# Altium schematic sheet Hard.SchDoc
size 420 x 297 mm; SheetNumber: 2; SheetTotal: 3
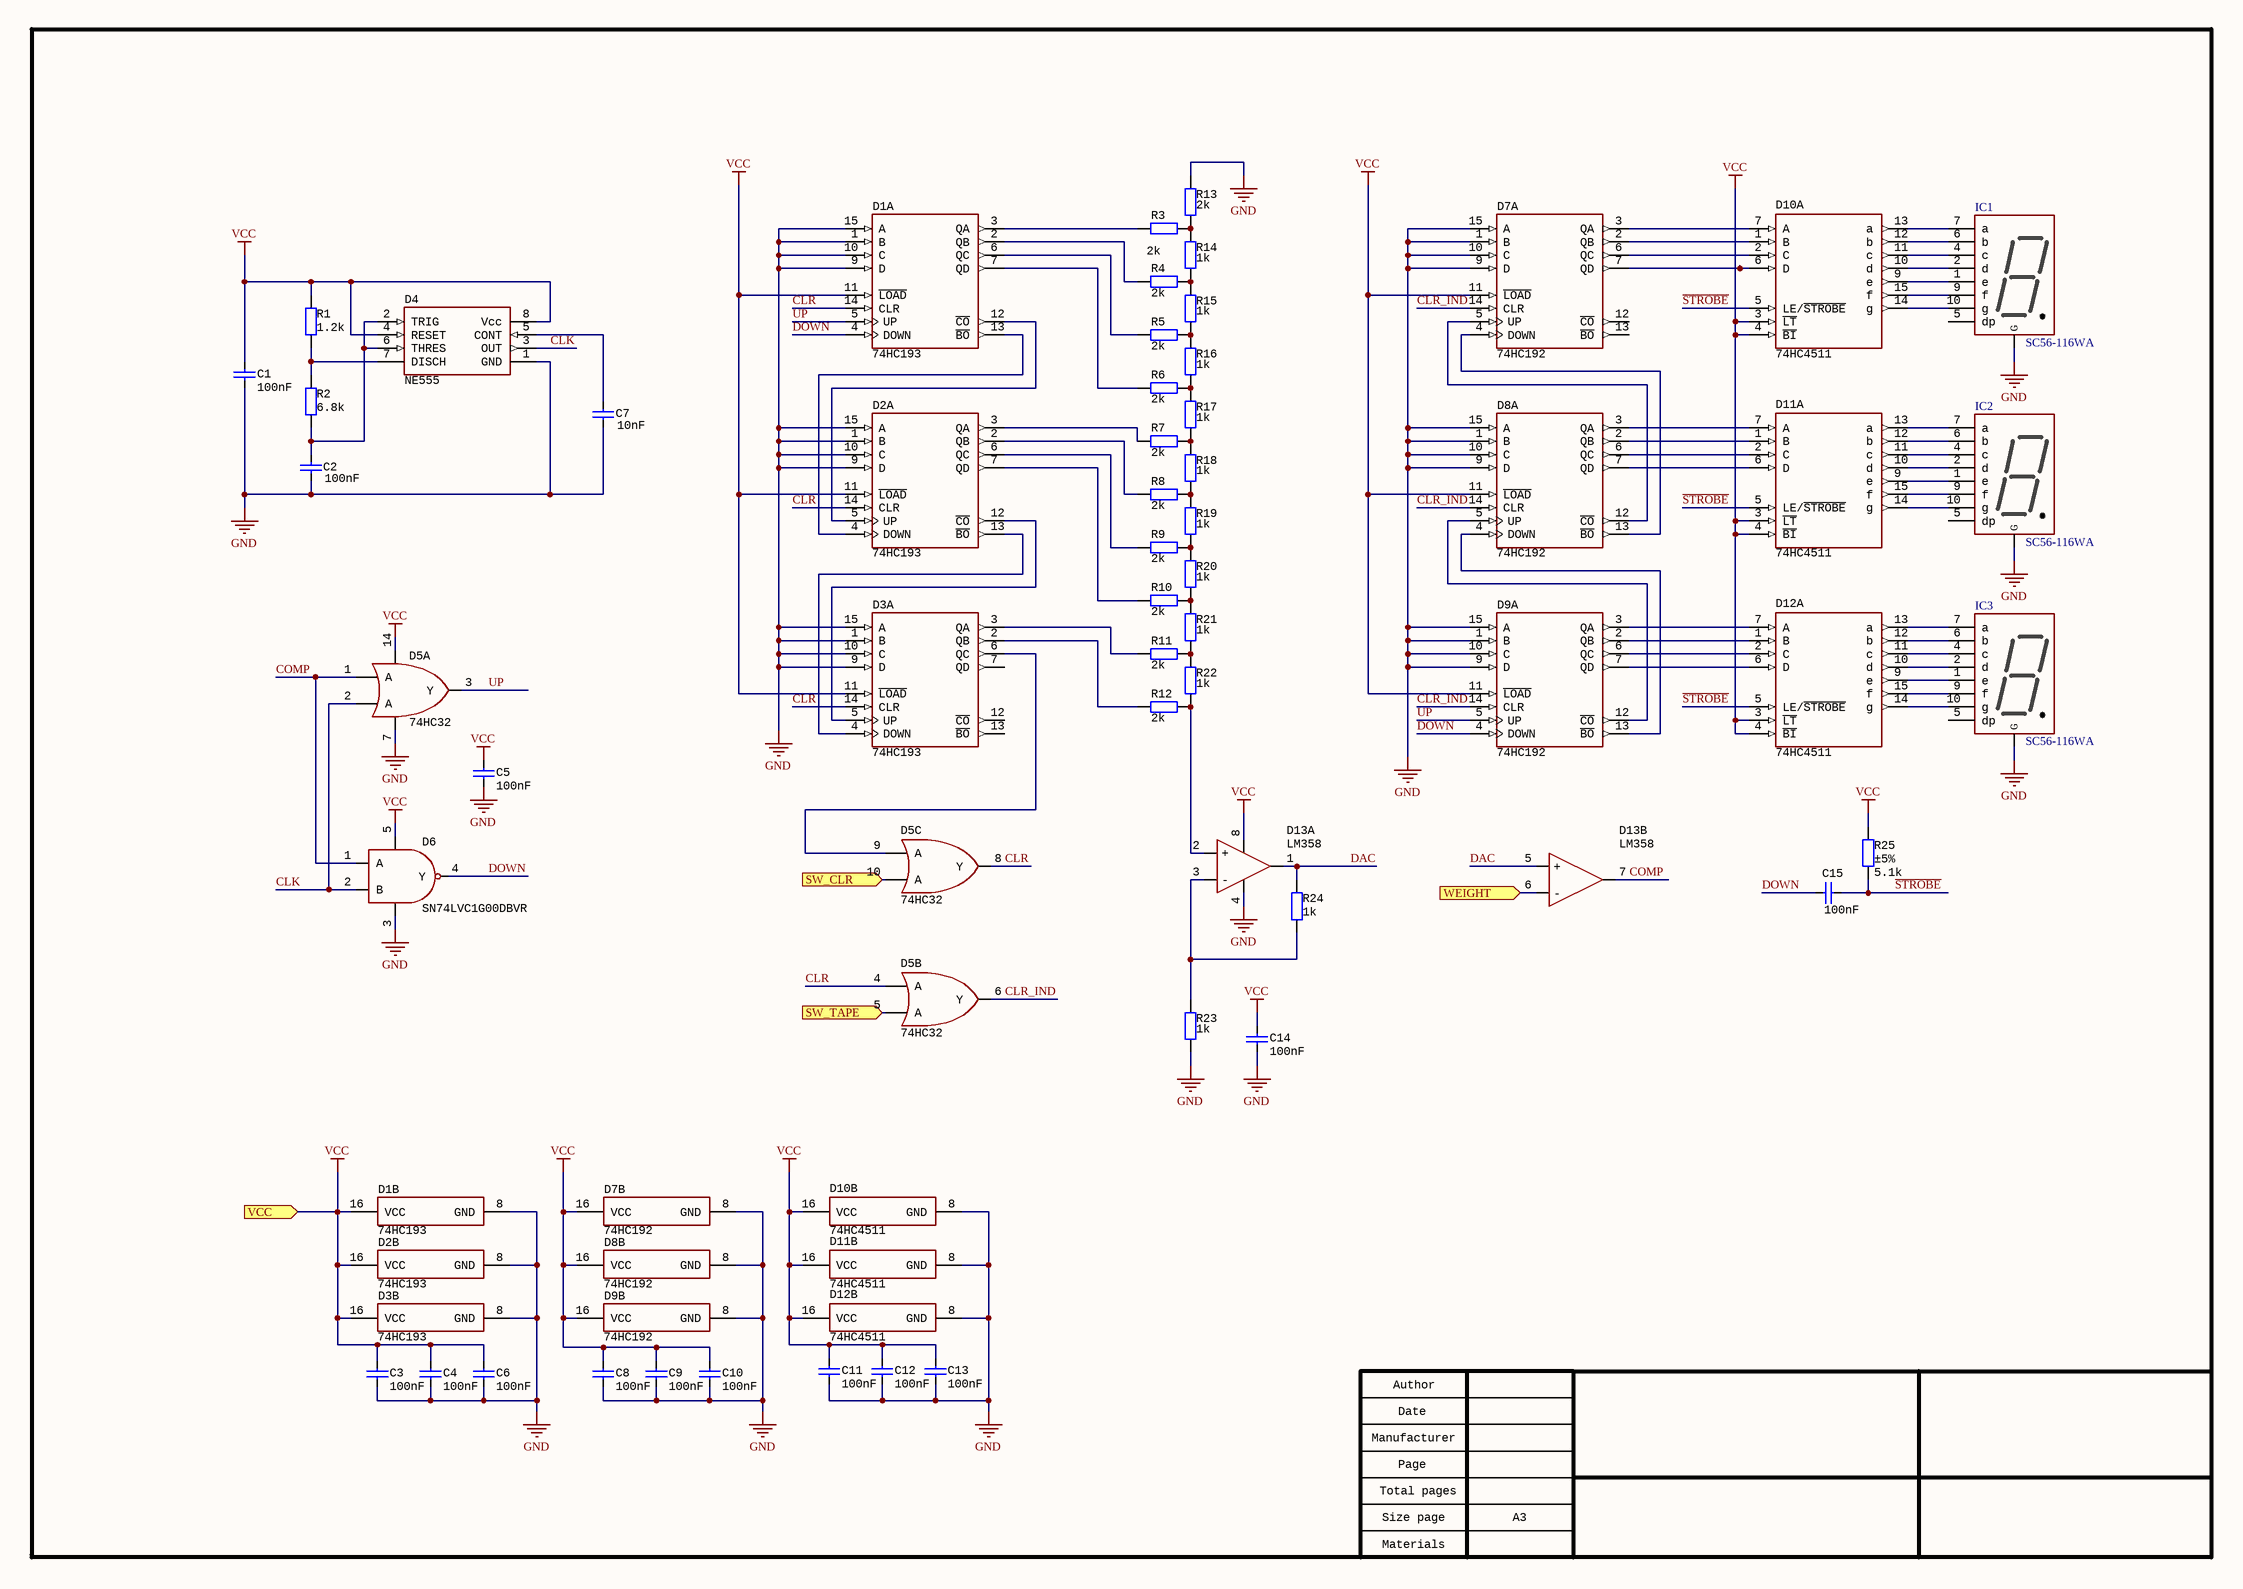
[diagram p0: Hard.SchDoc]

## Parts
C1  value 100nF  [CAP: ECHU(X) K (0603)]
C2  value 100nF  [CAP: ECHU(X) K (0603)]
C3  value 100nF  [CAP: ECHU(X) K (0603)]
C4  value 100nF  [CAP: ECHU(X) K (0603)]
C5  value 100nF  [CAP: ECHU(X) K (0603)]
C6  value 100nF  [CAP: ECHU(X) K (0603)]
C7  value 10nF  [CAP: ECHU(X) K (0603)]
C8  value 100nF  [CAP: ECHU(X) K (0603)]
C9  value 100nF  [CAP: ECHU(X) K (0603)]
C10  value 100nF  [CAP: ECHU(X) K (0603)]
C11  value 100nF  [CAP: ECHU(X) K (0603)]
C12  value 100nF  [CAP: ECHU(X) K (0603)]
C13  value 100nF  [CAP: ECHU(X) K (0603)]
C14  value 100nF  [CAP: ECHU(X) K (0603)]
C15  value 100nF  [CAP: ECHU(X) K (0603)]
D1  74HC193  [16-SO]  (parts A,B of 2)
D2  74HC193  [16-SO]  (parts A,B of 2)
D3  74HC193  [16-SO]  (parts A,B of 2)
D4  NE555  [8-SOIC]
D5  (no value)  [14-SOIC]  (parts A,B,C of 4)
D6  (no value)  [SOT23-5]
D7  74HC192  [16-SO]  (parts A,B of 2)
D8  74HC192  [16-SO]  (parts A,B of 2)
D9  74HC192  [16-SO]  (parts A,B of 2)
D10  74HC4511  [16-SO]  (parts A,B of 2)
D11  74HC4511  [16-SO]  (parts A,B of 2)
D12  74HC4511  [16-SO]  (parts A,B of 2)
D13  LM358  [8-SOIC]  (parts A,B of 2)
IC1  SC56-116WA  [SC56-116WA]
IC2  SC56-116WA  [SC56-116WA]
IC3  SC56-116WA  [SC56-116WA]
R1  value 1.2k  [RES: 0402]
R2  value 6.8k  [RES: 0402]
R3  value 2k  [RES: 0402]
R4  value 2k  [RES: 0402]
R5  value 2k  [RES: 0402]
R6  value 2k  [RES: 0402]
R7  value 2k  [RES: 0402]
R8  value 2k  [RES: 0402]
R9  value 2k  [RES: 0402]
R10  value 2k  [RES: 0402]
R11  value 2k  [RES: 0402]
R12  value 2k  [RES: 0402]
R13  value 2k  [RES: 0402]
R14  value 1k  [RES: 0402]
R15  value 1k  [RES: 0402]
R16  value 1k  [RES: 0402]
R17  value 1k  [RES: 0402]
R18  value 1k  [RES: 0402]
R19  value 1k  [RES: 0402]
R20  value 1k  [RES: 0402]
R21  value 1k  [RES: 0402]
R22  value 1k  [RES: 0402]
R23  value 1k  [RES: 0402]
R24  value 1k  [RES: 0402]
R25  value 5.1k  Tolerance: ±5%  [RES: 0402]

## Ports
SW_CLR (in), SW_TAPE (in), VCC (in), WEIGHT (in)

## Nets
GND: C1.1 C2.1 C3.1 C4.1 C5.1 C6.1 C7.1 C8.1 C9.1 C10.1 C11.1 C12.1 C13.1 C14.1 D1.1(B) D1.8(GND) D1.9(D) D1.10(C) D1.15(A) D2.1(B) D2.8(GND) D2.9(D) D2.10(C) D2.15(A) D3.1(B) D3.8(GND) D3.9(D) D3.10(C) D3.15(A) D4.1(GND) D5.7 D6.3 D7.1(B) D7.8(GND) D7.9(D) D7.10(C) D7.15(A) D8.1(B) D8.8(GND) D8.9(D) D8.10(C) D8.15(A) D9.1(B) D9.8(GND) D9.9(D) D9.10(C) D9.15(A) D10.8(GND) D11.8(GND) D12.8(GND) D13.4 IC1.G IC2.G IC3.G R13.2 R23.1
VCC: C1.2 C3.2 C4.2 C5.2 C6.2 C8.2 C9.2 C10.2 C11.2 C12.2 C13.2 C14.2 D1.11(~{LOAD}) D1.16(VCC) D2.11(~{LOAD}) D2.16(VCC) D3.11(~{LOAD}) D3.16(VCC) D4.4(RESET) D4.8(Vcc) D5.14 D6.5 D7.11(~{LOAD}) D7.16(VCC) D8.11(~{LOAD}) D8.16(VCC) D9.11(~{LOAD}) D9.16(VCC) D10.3(~{LT}) D10.4(~{BI}) D10.16(VCC) D11.3(~{LT}) D11.4(~{BI}) D11.16(VCC) D12.3(~{LT}) D12.4(~{BI}) D12.16(VCC) D13.8 R1.1 R25.2 ; port VCC
CLK: D4.3(OUT) D5.2(A) D6.2(B)
CLR: D1.14(CLR) D2.14(CLR) D3.14(CLR) D5.4(A) D5.8(Y)
CLR_IND: D5.6(Y) D7.14(CLR) D8.14(CLR) D9.14(CLR)
COMP: D5.1(A) D6.1(A) D13.7
DAC: D13.1 D13.5(+) R24.1
DOWN: C15.1 D1.4(DOWN) D6.4(Y) D9.4(DOWN)
~{STROBE}: C15.2 D10.5(LE/~{STROBE}) D11.5(LE/~{STROBE}) D12.5(LE/~{STROBE}) R25.1
SW_CLR: D5.10(A) ; port SW_CLR
SW_TAPE: D5.5(A) ; port SW_TAPE
UP: D1.5(UP) D5.3(Y) D9.5(UP)
WEIGHT: D13.6(-) ; port WEIGHT
NetC2_2: C2.2 D4.2(TRIG) D4.6(THRES) R2.2
NetC7_2: C7.2 D4.5(CONT)
NetD1_2: D1.2(QB) R4.2
NetD1_3: D1.3(QA) R3.2
NetD1_6: D1.6(QC) R5.2
NetD1_7: D1.7(QD) R6.2
NetD1_12: D1.12(~{CO}) D2.5(UP)
NetD1_13: D1.13(~{BO}) D2.4(DOWN)
NetD2_2: D2.2(QB) R8.2
NetD2_3: D2.3(QA) R7.2
NetD2_6: D2.6(QC) R9.2
NetD2_7: D2.7(QD) R10.2
NetD2_12: D2.12(~{CO}) D3.5(UP)
NetD2_13: D2.13(~{BO}) D3.4(DOWN)
NetD3_2: D3.2(QB) R12.2
NetD3_3: D3.3(QA) R11.2
NetD3_6: D3.6(QC) D5.9(A)
NetD4_7: D4.7(DISCH) R1.2 R2.1
NetD7_2: D7.2(QB) D10.1(B)
NetD7_3: D7.3(QA) D10.7(A)
NetD7_4: D7.4(DOWN) D8.13(~{BO})
NetD7_5: D7.5(UP) D8.12(~{CO})
NetD7_6: D7.6(QC) D10.2(C)
NetD7_7: D7.7(QD) D10.6(D)
NetD8_2: D8.2(QB) D11.1(B)
NetD8_3: D8.3(QA) D11.7(A)
NetD8_4: D8.4(DOWN) D9.13(~{BO})
NetD8_5: D8.5(UP) D9.12(~{CO})
NetD8_6: D8.6(QC) D11.2(C)
NetD8_7: D8.7(QD) D11.6(D)
NetD9_2: D9.2(QB) D12.1(B)
NetD9_3: D9.3(QA) D12.7(A)
NetD9_6: D9.6(QC) D12.2(C)
NetD9_7: D9.7(QD) D12.6(D)
NetD10_9: D10.9(e) IC1.1(e)
NetD10_10: D10.10(d) IC1.2(d)
NetD10_11: D10.11(c) IC1.4(c)
NetD10_12: D10.12(b) IC1.6(b)
NetD10_13: D10.13(a) IC1.7(a)
NetD10_14: D10.14(g) IC1.10(g)
NetD10_15: D10.15(f) IC1.9(f)
NetD11_9: D11.9(e) IC2.1(e)
NetD11_10: D11.10(d) IC2.2(d)
NetD11_11: D11.11(c) IC2.4(c)
NetD11_12: D11.12(b) IC2.6(b)
NetD11_13: D11.13(a) IC2.7(a)
NetD11_14: D11.14(g) IC2.10(g)
NetD11_15: D11.15(f) IC2.9(f)
NetD12_9: D12.9(e) IC3.1(e)
NetD12_10: D12.10(d) IC3.2(d)
NetD12_11: D12.11(c) IC3.4(c)
NetD12_12: D12.12(b) IC3.6(b)
NetD12_13: D12.13(a) IC3.7(a)
NetD12_14: D12.14(g) IC3.10(g)
NetD12_15: D12.15(f) IC3.9(f)
NetD13_2: D13.2(+) R12.1 R22.1
NetD13_3: D13.3(-) R23.2 R24.2
NetR3_1: R3.1 R13.1 R14.2
NetR4_1: R4.1 R14.1 R15.2
NetR5_1: R5.1 R15.1 R16.2
NetR6_1: R6.1 R16.1 R17.2
NetR7_1: R7.1 R17.1 R18.2
NetR8_1: R8.1 R18.1 R19.2
NetR9_1: R9.1 R19.1 R20.2
NetR10_1: R10.1 R20.1 R21.2
NetR11_1: R11.1 R21.1 R22.2

Not connected (* = marked no-connect by the designer): D3 7(QD) 12(~{CO}) 13(~{BO}); D7 12(~{CO}) 13(~{BO}); IC1 5(dp); IC2 5(dp); IC3 5(dp)

## Notes on the sheet
- Author
- Manufacturer
- Date
- Page
- Total pages
- Size page
- A3
- Materials

## Library data of the parts
C1-C6 C8-C15 = Film: Manufacturer: Epcos; PartNumber: B32774D4106K000; ValueManufacturerPartNumber: Film capacitor, 100nF, 15VDC, ±10%, 10.9mOhm, 31.5x15 mm, -40...+105°C; TypeCapacitor: Film capacitor; Tolerance: ±10%; Impedance: 10.9mOhm; Voltage: 15VDC; Package: 31.5x15 mm; HelpURL: https://www.digikey.com/products/en/capacitors/film-capacitors/62?k=&pkeyword=&sv=0&pv2097=1958&sf=0&FV=fffc01ef%2C1f140000%2Cffe0003e%2Cffec6366&quantity=1&ColumnSort=1000011&page=1&stock=1&pageSize=25; Temperature: -40...+105°C
C7 = Film: Manufacturer: Epcos; PartNumber: B32774D4106K000; ValueManufacturerPartNumber: Film capacitor, 10nF, 15VDC, ±10%, 10.9mOhm, 31.5x15 mm, -40...+105°C; TypeCapacitor: Film capacitor; Tolerance: ±10%; Impedance: 10.9mOhm; Voltage: 15VDC; Package: 31.5x15 mm; HelpURL: https://www.digikey.com/products/en/capacitors/film-capacitors/62?k=&pkeyword=&sv=0&pv2097=1958&sf=0&FV=fffc01ef%2C1f140000%2Cffe0003e%2Cffec6366&quantity=1&ColumnSort=1000011&page=1&stock=1&pageSize=25; Temperature: -40...+105°C
D1-D3 = 74HC193: Counter
D4 = NE555: Counter
D5 = 74HC32: OR; Manufacturer: Texas Instruments; ValueManufacturerPartNumber: IC logic OR, 1.65...5.5V, -40...+125°C, SOT23-6; Supply: 1.65...5.5V; HelpURL: https://www.digikey.com/product-detail/en/texas-instruments/SN74LVC1G332DBVR/296-18587-1-ND/857355; Package: SOT23-6; ComponentType: IC logic OR; Temperature: -40...+125°C; PartNumber: 74HC32
D6 = SN74LVC1G00DBVR: NAND; Manufacturer: Texas Instruments; ValueManufacturerPartNumber: IC logic AND, 1.65...5.5V, -40...+125°C, SC-70-5; Supply: 1.65...5.5V; HelpURL: https://ru.mouser.com/ProductDetail/Texas-Instruments/SN74LVC1G132DCKR?qs=nqigI8dpoHL8JNZWqteaEg%3D%3D; Package: SC-70-5; ComponentType: IC logic AND; Temperature: -40...+125°C; PartNumber: SN74LVC1G00DBVR
D7-D9 = 74HC192: Counter
D10-D12 = 74HC4511: 7-seg decoder
D13 = LM358: Comparator; Manufacturer: Microchip Technology; ValueManufacturerPartNumber: IC comparator, Rail-to-Rail, 1.6...5.5V, -40...+85°C, SOT23-5; Supply: 1.6...5.5V; OutputType: Rail-to-Rail; HelpURL: https://www.digikey.com/product-detail/en/microchip-technology/MCP6541T-I-OT/MCP6541T-I-OTCT-ND/3622387; Package: SOT23-5; ComponentType: IC comparator; Temperature: -40...+85°C
R1 = Resistor_2: Manufacturer: Yageo; PartNumber: RC0201JR-07100RL; ValueManufacturerPartNumber: Resistor film, 1.2k, ±5%, 0201, 0.05W, -55...+125°C; TypeResistor: Resistor film; Power: 0.05W; Tolerance: ±5%; Package: 0201; HelpURL: https://www.digikey.com/product-detail/en/yageo/RC0201JR-07100RL/311-100NCT-ND/1949006; Temperature: -55...+125°C
R2 = Resistor_2: Manufacturer: Yageo; PartNumber: RC0201JR-07100RL; ValueManufacturerPartNumber: Resistor film, 6.8k, ±5%, 0201, 0.05W, -55...+125°C; TypeResistor: Resistor film; Power: 0.05W; Tolerance: ±5%; Package: 0201; HelpURL: https://www.digikey.com/product-detail/en/yageo/RC0201JR-07100RL/311-100NCT-ND/1949006; Temperature: -55...+125°C
R3-R13 = Resistor_2: Manufacturer: Yageo; PartNumber: RC0201JR-07100RL; ValueManufacturerPartNumber: Resistor film, 2k, ±5%, 0201, 0.05W, -55...+125°C; TypeResistor: Resistor film; Power: 0.05W; Tolerance: ±5%; Package: 0201; HelpURL: https://www.digikey.com/product-detail/en/yageo/RC0201JR-07100RL/311-100NCT-ND/1949006; Temperature: -55...+125°C
R14-R24 = Resistor_2: Manufacturer: Yageo; PartNumber: RC0201JR-07100RL; ValueManufacturerPartNumber: Resistor film, 1k, ±5%, 0201, 0.05W, -55...+125°C; TypeResistor: Resistor film; Power: 0.05W; Tolerance: ±5%; Package: 0201; HelpURL: https://www.digikey.com/product-detail/en/yageo/RC0201JR-07100RL/311-100NCT-ND/1949006; Temperature: -55...+125°C
R25 = Resistor_2: Manufacturer: Yageo; PartNumber: RC0201JR-07100RL; ValueManufacturerPartNumber: Resistor film, 5.1k, ±5%, 0201, 0.05W, -55...+125°C; TypeResistor: Resistor film; Power: 0.05W; Package: 0201; HelpURL: https://www.digikey.com/product-detail/en/yageo/RC0201JR-07100RL/311-100NCT-ND/1949006; Temperature: -55...+125°C